# Altium project WB-AV-4502-PDB.PrjPcb
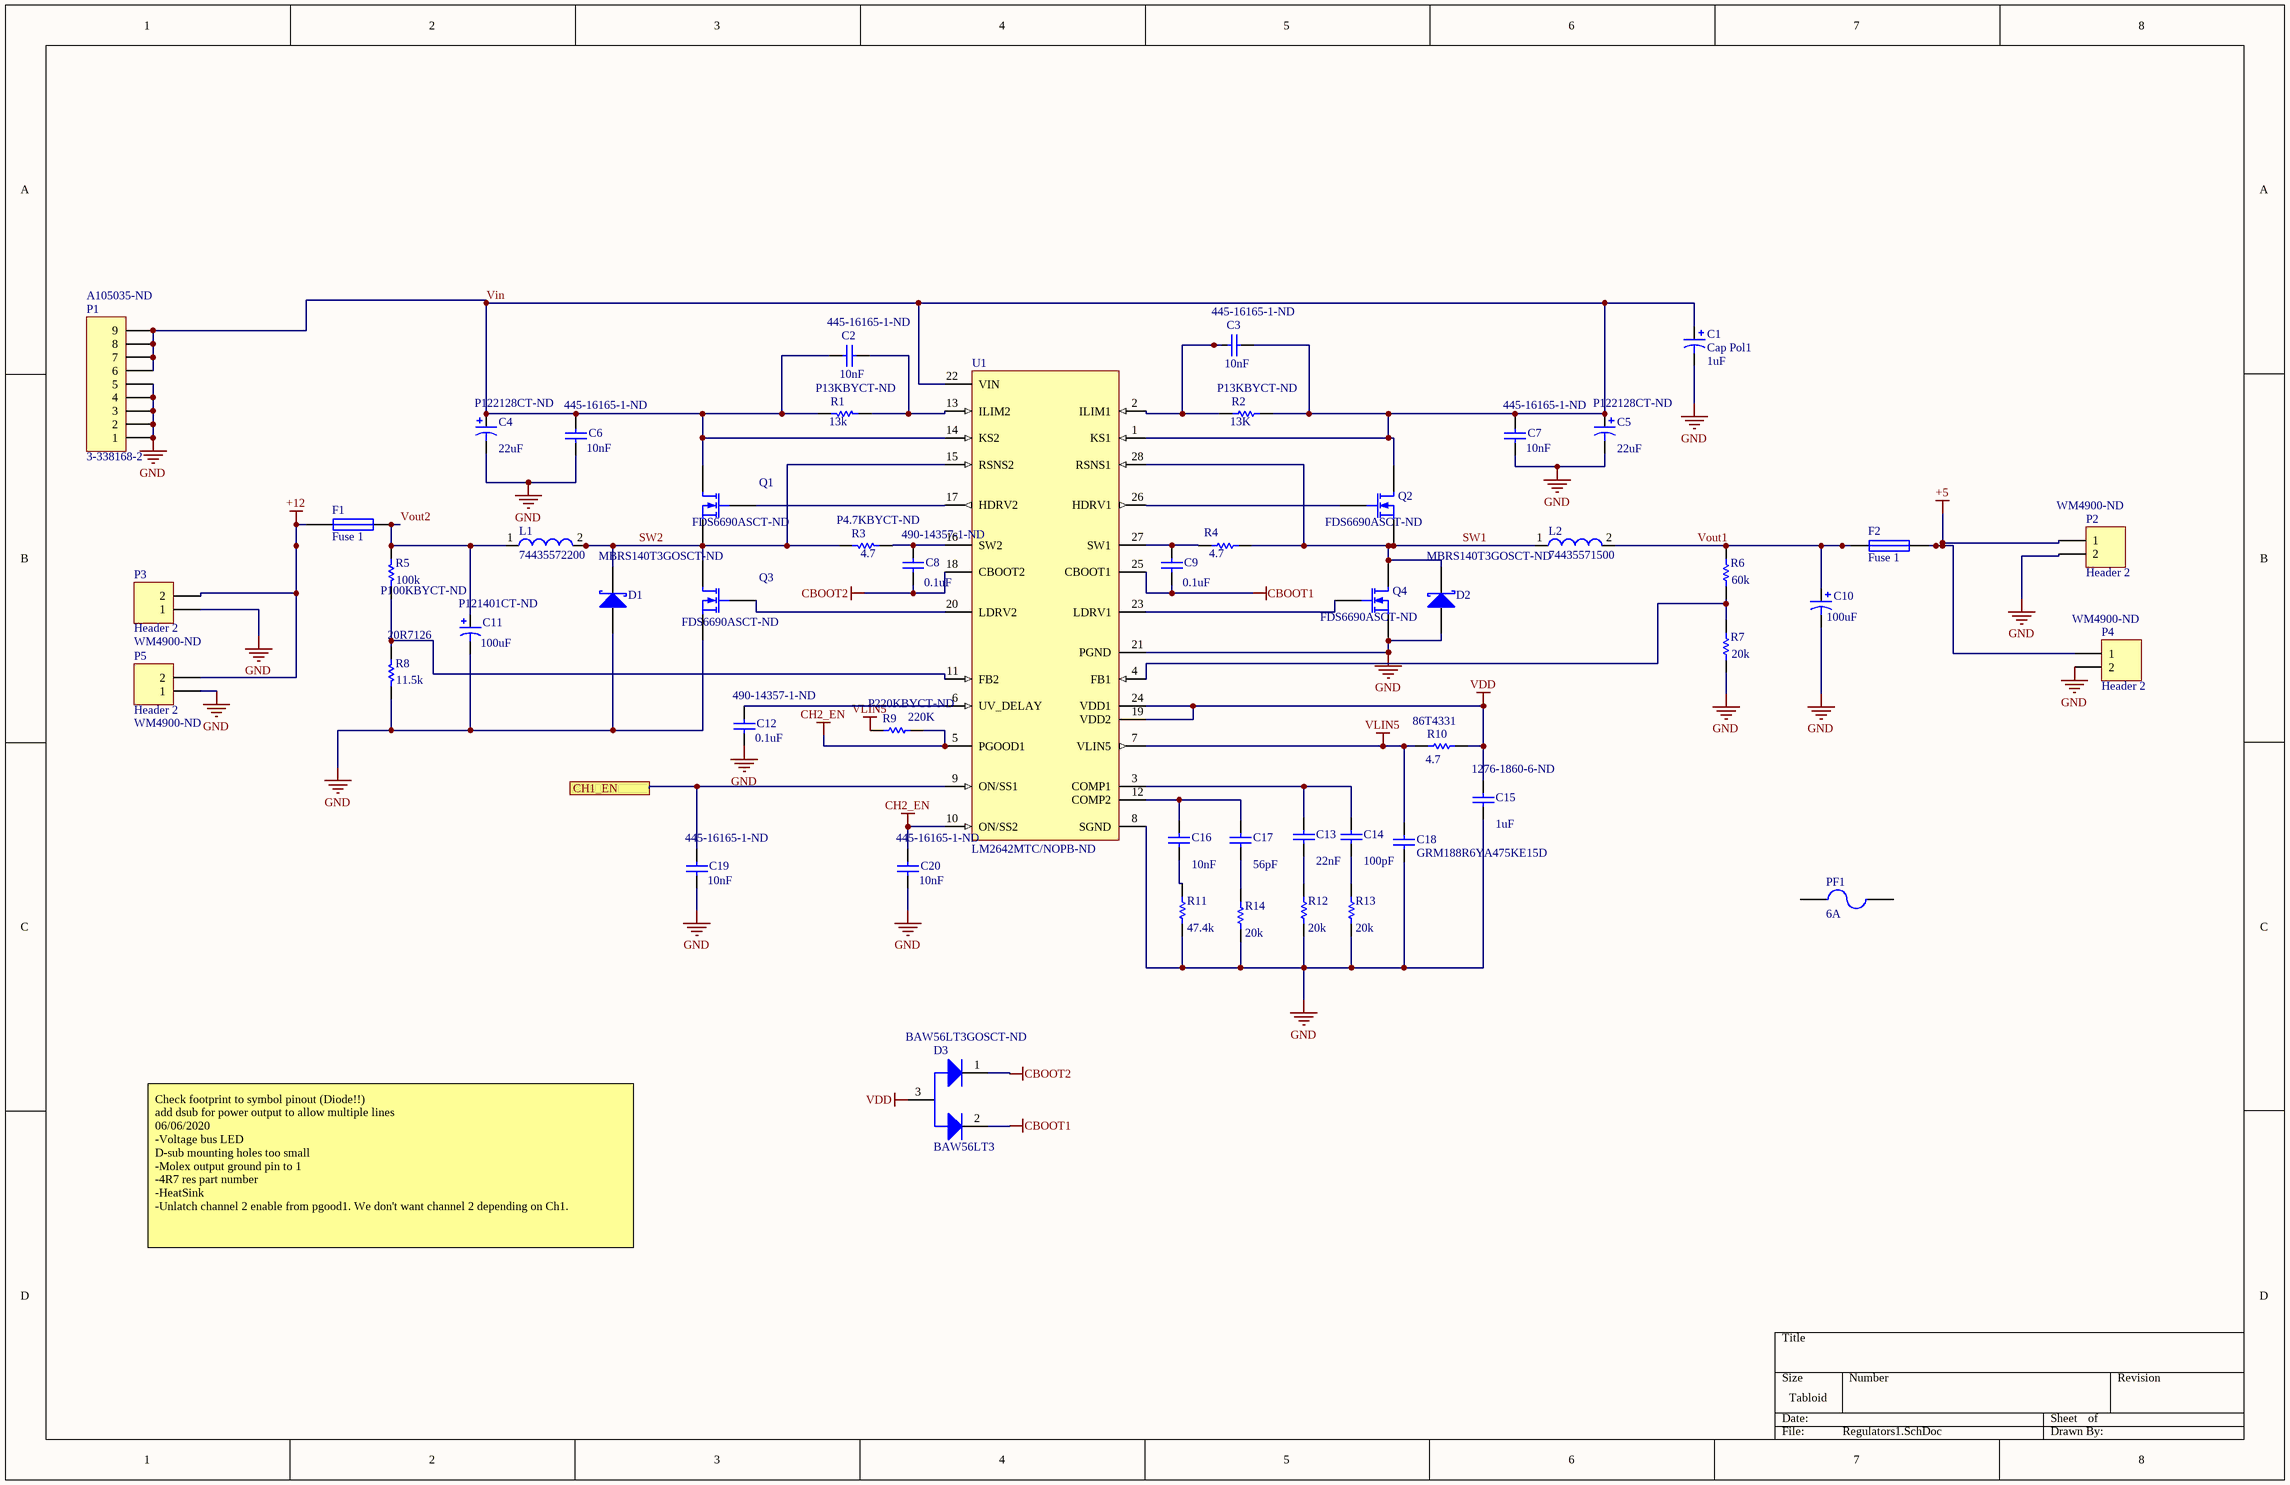
[diagram p0: Regulators1.SchDoc]
1 sheet, 52 parts. Net scope: flat (ports and power ports of the same name join across sheets).
Board file: WB-AV-4502-PDB-REV-0.pcbdoc

## Sheet Regulators1.SchDoc
size Tabloid

### Parts
C1  Cap Pol1  value 1uF  [1u50VcapE]
C2  value 10nF  Supplier Part Number 1: 445-16165-1-ND  [1608[0603]]  (hidden comment: Cap)
C3  value 10nF  Supplier Part Number 1: 445-16165-1-ND  [1608[0603]]  (hidden comment: Cap)
C4  value 22uF  Supplier Part Number 1: P122128CT-ND  [CAPAE660X800N]  (hidden comment: Cap Pol1)
C5  value 22uF  Supplier Part Number 1: P122128CT-ND  [CAPAE660X800N]  (hidden comment: Cap Pol1)
C6  value 10nF  Supplier Part Number 1: 445-16165-1-ND  [1608[0603]]  (hidden comment: Cap)
C7  value 10nF  Supplier Part Number 1: 445-16165-1-ND  [1608[0603]]  (hidden comment: Cap)
C8  value 0.1uF  Supplier Part Number 1: 490-14357-1-ND  [1608[0603]]  (hidden comment: Cap)
C9  value 0.1uF  [1608[0603]]  (hidden comment: Cap)
C10  value 100uF  [CAPAE660X800N]  (hidden comment: Cap Pol1)
C11  value 100uF  Supplier Part Number 1: P121401CT-ND  [CAPAE660X800N]  (hidden comment: Cap Pol1)
C12  value 0.1uF  Supplier Part Number 1: 490-14357-1-ND  [1608[0603]]  (hidden comment: Cap)
C13  value 22nF  [1608[0603]]  (hidden comment: Cap)
C14  value 100pF  [1608[0603]]  (hidden comment: Cap)
C15  value 1uF  Supplier Part Number 1: 1276-1860-6-ND  [1608[0603]]  (hidden comment: Cap)
C16  value 10nF  [1608[0603]]  (hidden comment: Cap)
C17  value 56pF  [1608[0603]]  (hidden comment: Cap)
C18  GRM188R6YA475KE15D  [CAPC1608X90X35LL10T15]
C19  value 10nF  Supplier Part Number 1: 445-16165-1-ND  [1608[0603]]  (hidden comment: Cap)
C20  value 10nF  Supplier Part Number 1: 445-16165-1-ND  [1608[0603]]  (hidden comment: Cap)
D1  Supplier Part Number 1: MBRS140T3GOSCT-ND  [*DIOM5227X270N_S1M(Primary)]  (hidden comment: Diode MBRS140t3)
D2  Supplier Part Number 1: MBRS140T3GOSCT-ND  [*DIOM5227X270N_S1M(Primary)]  (hidden comment: Diode MBRS140t3)
D3  BAW56LT3  Supplier Part Number 1: BAW56LT3GOSCT-ND  [ONSC-SOT-23-3-318-08_V]
F1  Fuse 1  [C1206]
F2  Fuse 1  [C1206]
L1  74435572200  [WE-HCI-1890]
L2  74435571500  [WE-HCI-1890]
P1  3-338168-2  Supplier Part Number 1: A105035-ND  [CONN_3-338168-2]
P2  Header 2  [WM4900-ND]
P3  Header 2  [WM4900-ND]
P4  Header 2  [WM4900-ND]
P5  Header 2  [WM4900-ND]
PF1  6A  [RESC3216X125N]
Q1  Supplier Part Number 1: FDS6690ASCT-ND  [*SOIC127P600X175-8N]  (hidden comment: MOSFET-N)
Q2  Supplier Part Number 1: FDS6690ASCT-ND  [*SOIC127P600X175-8N]  (hidden comment: MOSFET-N)
Q3  Supplier Part Number 1: FDS6690ASCT-ND  [*SOIC127P600X175-8N]  (hidden comment: MOSFET-N)
Q4  Supplier Part Number 1: FDS6690ASCT-ND  [*SOIC127P600X175-8N]  (hidden comment: MOSFET-N)
R1  value 13k  Supplier Part Number 1: P13KBYCT-ND  [1608[0603]]  (hidden comment: Res1)
R2  value 13K  Supplier Part Number 1: P13KBYCT-ND  [1608[0603]]  (hidden comment: Res1)
R3  value 4.7  Supplier Part Number 1: P4.7KBYCT-ND  [1608[0603]]  (hidden comment: Res1)
R4  value 4.7  [1608[0603]]  (hidden comment: Res1)
R5  value 100k  Supplier Part Number 1: P100KBYCT-ND  [1608[0603]]  (hidden comment: Res1)
R6  value 60k  [1608[0603]]  (hidden comment: Res1)
R7  value 20k  [1608[0603]]  (hidden comment: Res1)
R8  value 11.5k  Supplier Part Number 1: 20R7126  [1608[0603]]  (hidden comment: Res1)
R9  value 220K  Supplier Part Number 1: P220KBYCT-ND  [1608[0603]]  (hidden comment: Res1)
R10  value 4.7  Supplier Part Number 1: 86T4331  [1608[0603]]  (hidden comment: Res1)
R11  value 47.4k  [1608[0603]]  (hidden comment: Res1)
R12  value 20k  [1608[0603]]  (hidden comment: Res1)
R13  value 20k  [1608[0603]]  (hidden comment: Res1)
R14  value 20k  [1608[0603]]  (hidden comment: Res1)
U1  Supplier Part Number 1: LM2642MTC/NOPB-ND  [MTC28_N]  (hidden comment: LM2642MTC/NOPB)

### Ports
CH1_EN

### Nets
+5: F2.2 P2.1 P4.1
+12: F1.1 P3.2 P5.2
CBOOT1: C9.1 D3.2(K2) U1.25(CBOOT1)
CBOOT2: C8.1 D3.1(K1) U1.18(CBOOT2)
CH2_EN: C20.2 R9.2 U1.5(PGOOD1) U1.10(ON/SS2)
GND: C1.2 C4.2 C5.2 C6.1 C7.1 C10.2 C11.2 C12.1 C15.1 C18.1 C19.1 C20.1 D1.3(A) D2.3(A) P1.1 P1.2 P1.3 P1.4 P1.5 P2.2 P3.1 P4.2 P5.1 Q3.3(S) Q4.3(S) R7.1 R8.1 R11.1 R12.1 R13.1 R14.1 U1.8(SGND) U1.21(PGND)
VDD: C15.2 D3.3(A) R10.2 U1.19(VDD2) U1.24(VDD1)
VLIN5: C18.2 R9.1 R10.1 U1.7(VLIN5)
SW1: D2.1(K) L2.1 Q2.3(S) Q4.1(D) R4.2 U1.28(RSNS1)
SW2: D1.1(K) L1.2 Q1.3(S) Q3.1(D) R3.2 U1.15(RSNS2)
Vin: C1.1 C2.2 C3.1 C4.1 C5.1 C6.2 C7.2 P1.6 P1.7 P1.8 P1.9 Q1.1(D) Q2.1(D) R1.2 R2.2 U1.1(KS1) U1.14(KS2) U1.22(VIN)
Vout1: C10.1 F2.1 L2.2 R6.2
Vout2: C11.1 F1.2 L1.1 R5.2
NetC2_1: C2.1 R1.1 U1.13(ILIM2)
NetC3_2: C3.2 R2.1 U1.2(ILIM1)
NetC8_2: C8.2 R3.1 U1.16(SW2)
NetC9_2: C9.2 R4.1 U1.27(SW1)
NetC12_2: C12.2 U1.6(UV_DELAY)
NetC13_1: C13.1 R12.2
NetC13_2: C13.2 C14.2 U1.3(COMP1)
NetC14_1: C14.1 R13.2
NetC16_1: C16.1 R11.2
NetC16_2: C16.2 C17.2 U1.12(COMP2)
NetC17_1: C17.1 R14.2
NetC19_2: C19.2 U1.9(ON/SS1) ; port CH1_EN
NetQ1_2: Q1.2(G) U1.17(HDRV2)
NetQ2_2: Q2.2(G) U1.26(HDRV1)
NetQ3_2: Q3.2(G) U1.20(LDRV2)
NetQ4_2: Q4.2(G) U1.23(LDRV1)
NetR5_1: R5.1 R8.2 U1.11(FB2)
NetR6_1: R6.1 R7.2 U1.4(FB1)

Not connected (* = marked no-connect by the designer): PF1 1 2

### Notes on the sheet
- Check footprint to symbol pinout (Diode!!)
  add dsub for power output to allow multiple lines
  06/06/2020
  -Voltage bus LED
  D-sub mounting holes too small
  -Molex output ground pin to 1
  -4R7 res part number
  -HeatSink
  -Unlatch channel 2 enable from pgood1. We don't want channel 2 depending on Ch1.

### Library data of the parts
C1 = Cap Pol1: Polarized Capacitor (Radial); SPN: 865060640001; Published: 8-Jun-2000; LatestRevisionDate: 17-Jul-2002; LatestRevisionNote: Re-released for DXP Platform.; PackageReference: RB7.6-15; Publisher: Altium Limited; PackageDescription: Polarized Capacitor (Radial); 2 Leads
C2 C3 C6 C7 C16 C19 C20 = Cap: CAP CER 10000PF 100V NP0 0603; Manufacturer: TDK; Manufacturer Part Number: CGA3EANP02A103J080AC; Tolerance: 5%; Published: 8-Jun-2000; LatestRevisionDate: 17-Jul-2002; LatestRevisionNote: Re-released for DXP Platform.; PackageReference: RAD-0.3; Publisher: Altium Limited; PackageDescription: Radial Cap, Thru-Hole; 2 Leads; 0.3 in Pin Spacing; Supplier 1: Digi-Key; RoHS: Yes; Category: Ceramic Capacitors; Stock 1: 406; Pricing 1: 1=0.39000, 10=0.27200, 100=0.16300, 500=0.12226, 1000=0.10324 (USD); Mount: Surface Mount; Case/Package: 0603; Case Code (Metric): 1608; Case Code (Imperial): 0603; Min Operating Temperature: -55°C; Max Operating Temperature: 150°C; Packaging: Cut Tape; Capacitance: 10nF; Voltage Rating: 100V; Package Quantity: 1; Length: 0.063inch; Width: 0.031inch; Thickness: 0.035inch; Ratings: AEC-Q200; ComponentLink1URL: https://datasheet.ciiva.com/29540/mlcc-automotive-esd-en-29540271.pdf?src-supplier=Digi-Key; ComponentLink1Description: https://datasheet.ciiva.com/29540/mlcc-automotive-esd-en-29540271.pdf?src-supplier=Digi-Key
  C16: Supplier Part Number 1: 445-16165-1-ND
C4 C5 = Cap Pol1: Polarized Capacitor (Radial); Published: 8-Jun-2000; LatestRevisionDate: 17-Jul-2002; LatestRevisionNote: Re-released for DXP Platform.; PackageReference: RB7.6-15; Publisher: Altium Limited; PackageDescription: Polarized Capacitor (Radial); 2 Leads; Supplier 1: Digi-Key
C8 C9 C12 = Cap: CAP CER 0.1UF 50V X7R 0603; Manufacturer: Murata; Manufacturer Part Number: GCM188R71H104JA57D; Capacitance: 100nF; Tolerance: 5%; Published: 8-Jun-2000; LatestRevisionDate: 17-Jul-2002; LatestRevisionNote: Re-released for DXP Platform.; PackageReference: RAD-0.3; Publisher: Altium Limited; PackageDescription: Radial Cap, Thru-Hole; 2 Leads; 0.3 in Pin Spacing; Supplier 1: Digi-Key; RoHS: No; Category: Ceramic Capacitors; Stock 1: 31481; Pricing 1: 1=0.32000, 10=0.22100, 100=0.13260, 500=0.09944, 1000=0.08397 (USD); Mount: Surface Mount; Case/Package: 0603; Case Code (Imperial): 0603; Case Code (Metric): 1608; Min Operating Temperature: -55°C; Max Operating Temperature: 125°C; Dielectric: X7R; Voltage Rating (DC): 50V; Packaging: Cut Tape; Voltage Rating: 50V; Ratings: AEC-Q200; ComponentLink1URL: http://search.murata.co.jp/Ceramy/image/img/A01X/partnumbering_e_02.pdf?src-supplier=Digi-Key; ComponentLink1Description: http://search.murata.co.jp/Ceramy/image/img/A01X/partnumbering_e_02.pdf?src-supplier=Digi-Key; ComponentLink2URL: https://www.murata.com/~/media/webrenewal/support/library/catalog/products/capacitor/mlcc/c03e.ashx?la=en-us&src-supplier=Digi-Key; ComponentLink2Description: https://www.murata.com/~/media/webrenewal/support/library/catalog/products/capacitor/mlcc/c03e.ashx?la=en-us&src-supplier=Digi-Key
  C9: Supplier Part Number 1: 490-14357-1-ND
C10 C11 = Cap Pol1: Polarized Capacitor (Radial); SPN: P121401TR-ND; Published: 8-Jun-2000; LatestRevisionDate: 17-Jul-2002; LatestRevisionNote: Re-released for DXP Platform.; PackageReference: RB7.6-15; Publisher: Altium Limited; PackageDescription: Polarized Capacitor (Radial); 2 Leads; Supplier 1: Digi-Key
  C10: Supplier Part Number 1: P121401CT-ND
C13 = Cap: 0603 22 nF 50 V ±5% Tolerance X7R SMT Multilayer Ceramic Capacitor; Manufacturer: Walsin Technologies; Manufacturer Part Number: 0603B223J500CT; Voltage Rating: 50V; Published: 8-Jun-2000; LatestRevisionDate: 17-Jul-2002; LatestRevisionNote: Re-released for DXP Platform.; PackageReference: RAD-0.3; Publisher: Altium Limited; PackageDescription: Radial Cap, Thru-Hole; 2 Leads; 0.3 in Pin Spacing; Supplier 1: Digi-Key; Supplier Part Number 1: 1292-1414-1-ND; Category: Uncategorized; Stock 1: 14260; Pricing 1: 1=0.10000, 10=0.07500, 100=0.03350, 500=0.02390, 1000=0.01879 (USD); Case/Package: 0603; Case Code (Metric): 1608; Case Code (Imperial): 0603; Min Operating Temperature: -55°C; Max Operating Temperature: 125°C; Tolerance: 5%; Packaging: Tape and Reel; Capacitance: 22nF; Dielectric: X7R; Voltage Rating (DC): 50V; Length: 1.6mm; Depth: 0.8mm; Radiation Hardening: No; REACH SVHC: Unknown; Lead Free: Lead Free; ComponentLink1URL: https://datasheet.ciiva.com/26864/getdatasheetpartid-660917-26864527.pdf?src-supplier=Verical; ComponentLink1Description: https://datasheet.ciiva.com/26864/getdatasheetpartid-660917-26864527.pdf?src-supplier=Verical; ComponentLink2URL: http://datasheet.octopart.com/0603B223J500CT-Walsin-Technologies-datasheet-62066062.pdf?src-supplier=Element14; ComponentLink2Description: http://datasheet.octopart.com/0603B223J500CT-Walsin-Technologies-datasheet-62066062.pdf?src-supplier=Element14; ComponentLink3URL: http://datasheet.octopart.com/0603B223J500CT-Walsin-Technologies-datasheet-85392065.pdf?src-supplier=Element14; ComponentLink3Description: http://datasheet.octopart.com/0603B223J500CT-Walsin-Technologies-datasheet-85392065.pdf?src-supplier=Element14; ComponentLink4URL: http://datasheet.octopart.com/0603B223J500CT-Walsin-Technologies-datasheet-26371553.pdf; ComponentLink4Description: http://datasheet.octopart.com/0603B223J500CT-Walsin-Technologies-datasheet-26371553.pdf
C14 = Cap: Multilayer Ceramic Capacitors MLCC - SMD/SMT 100pF 50V X7R 5%; Manufacturer: Yageo; Manufacturer Part Number: CC0603JRX7R9BB101; Published: 8-Jun-2000; LatestRevisionDate: 17-Jul-2002; LatestRevisionNote: Re-released for DXP Platform.; PackageReference: RAD-0.3; Publisher: Altium Limited; PackageDescription: Radial Cap, Thru-Hole; 2 Leads; 0.3 in Pin Spacing; Supplier 1: Digi-Key; Supplier Part Number 1: 311-4003-1-ND; RoHS: Yes; Category: Ceramic Capacitors; Stock 1: 2652; Pricing 1: 1=0.11000, 10=0.08200, 100=0.03840, 500=0.02690, 1000=0.02228 (USD); Mount: Surface Mount; Case/Package: 0603; Case Code (Imperial): 0603; Case Code (Metric): 1608; Min Operating Temperature: -55°C; Max Operating Temperature: 125°C; Packaging: Tape and Reel; Tolerance: 5%; Voltage Rating: 50V; Capacitance: 100pF; Voltage Rating (DC): 50V; Package Quantity: 4000; Dielectric: X7R; Termination: SMD/SMT; Composition: Ceramic; Length: 1.6mm; Width: 0.031inch; Thickness: 0.035inch; Depth: 0.8mm; Radiation Hardening: No; Lead Free: Lead Free; Halogen Free: Halogen Free; ComponentLink1URL: https://datasheet.ciiva.com/26862/getdatasheetpartid-408467-26862784.pdf?src-supplier=Verical; ComponentLink1Description: https://datasheet.ciiva.com/26862/getdatasheetpartid-408467-26862784.pdf?src-supplier=Verical; ComponentLink2URL: https://datasheet.ciiva.com/5427/upy-gphc-x7r-6-3v-to-50v-9-270870-5427704.pdf?src-supplier=Mouser; ComponentLink2Description: https://datasheet.ciiva.com/5427/upy-gphc-x7r-6-3v-to-50v-9-270870-5427704.pdf?src-supplier=Mouser; ComponentLink3URL: https://datasheet.ciiva.com/17436/upy-gphc-x7r-6-3v-to-50v-8-17436870.pdf?src-supplier=Avnet+Europe; ComponentLink3Description: https://datasheet.ciiva.com/17436/upy-gphc-x7r-6-3v-to-50v-8-17436870.pdf?src-supplier=Avnet+Europe; ComponentLink4URL: https://datasheet.ciiva.com/11465/upy-gphc-x7r-6-3v-to-50v-8-11465037.pdf?src-supplier=Avnet; ComponentLink4Description: https://datasheet.ciiva.com/11465/upy-gphc-x7r-6-3v-to-50v-8-11465037.pdf?src-supplier=Avnet
C15 = Cap: Cap Ceramic 1uF 50V X5R 10% SMD 0603 85C Cardboard T/R; Manufacturer: Samsung; Manufacturer Part Number: CL10A105KB8NNNC; Published: 8-Jun-2000; LatestRevisionDate: 17-Jul-2002; LatestRevisionNote: Re-released for DXP Platform.; PackageReference: RAD-0.3; Publisher: Altium Limited; PackageDescription: Radial Cap, Thru-Hole; 2 Leads; 0.3 in Pin Spacing; Supplier 1: Digi-Key; RoHS: Yes; Category: Ceramic Capacitors; Stock 1: 1011841; Pricing 1: 1=0.17000, 10=0.12100, 100=0.05680, 500=0.03982, 1000=0.03297 (USD); Mount: Surface Mount; Case/Package: 0603; Case Code (Metric): 1608; Case Code (Imperial): 0603; Contact Plating: Tin; Min Operating Temperature: -55°C; Max Operating Temperature: 85°C; Package Quantity: 1; Packaging: Tape and Reel; Capacitance: 1uF; Tolerance: 10%; Voltage Rating: 50V; Dielectric: X5R; Termination: Wraparound; Length: 1.6mm; Width: 0.031inch; Thickness: 0.035inch; Depth: 0.8mm; Radiation Hardening: No; ComponentLink1URL: https://datasheet.ciiva.com/26877/getdatasheetpartid-753736-26877879.pdf?src-supplier=Verical; ComponentLink1Description: https://datasheet.ciiva.com/26877/getdatasheetpartid-753736-26877879.pdf?src-supplier=Verical
C17 = Cap: Chip Capacitor 0603 MLCC NPO 56 pF+/- 1% 50 V T&R GP; Manufacturer: Walsin Technologies; Manufacturer Part Number: 0603N560F500CT; Dielectric: C0G; Published: 8-Jun-2000; LatestRevisionDate: 17-Jul-2002; LatestRevisionNote: Re-released for DXP Platform.; PackageReference: RAD-0.3; Publisher: Altium Limited; PackageDescription: Radial Cap, Thru-Hole; 2 Leads; 0.3 in Pin Spacing; Supplier 1: Digi-Key; Supplier Part Number 1: 1292-1533-1-ND; Category: Uncategorized; Stock 1: 4492; Pricing 1: 1=0.12000, 10=0.09000, 100=0.04030, 500=0.02876, 1000=0.02260 (USD); Case/Package: 0603; Min Operating Temperature: -55°C; Max Operating Temperature: 125°C; Tolerance: 1%; Packaging: Tape and Reel; Capacitance: 56pF; Length: 1.6mm; Depth: 0.8mm; ComponentLink1URL: http://components.arrow.com/part/dataview/0323_03468640?src-supplier=Arrow+Europe; ComponentLink1Description: http://components.arrow.com/part/dataview/0323_03468640?src-supplier=Arrow+Europe; ComponentLink2URL: http://datasheet.octopart.com/0603N560F500CT-Walsin-Technologies-datasheet-26371553.pdf; ComponentLink2Description: http://datasheet.octopart.com/0603N560F500CT-Walsin-Technologies-datasheet-26371553.pdf
C18 = CMP-2006-02545-1: Manufacturer: Murata; Part Number: GRM188R6YA475KE15D
D1 D2 = Diode 18TQ045: Schottky Rectifier; pin to pad: 1>C 3>A; Note: Terminal 2 is the TAB and is electrically connected to the cathode; Published: 8-Jun-2000; LatestRevisionDate: 17-Jul-2002; LatestRevisionNote: Re-released for DXP Platform.; DatasheetVersion: Dec-1997; PackageVersion: Feb-1998; PackageReference: TO-220AC; Publisher: Altium Limited; PackageDescription: TO, Thru-Hole, Vertical, Heatsink Mounted; 3 In-Line Leads (1 Absent); Pitch 2.54 mm; ComponentLink1Description: Manufacturer Link; ComponentLink1URL: http://www.irf.com/; ComponentLink2Description: Datasheet; ComponentLink2URL: http://www.irf.com/product-info/datasheets/data/18tq.pdf; SPN: MBRS140T3GOSCT-ND; Supplier 1: Digi-Key
D3 = BAW56LT3: Diode Small Signal Switching 70V 0.2A Automotive 3-Pin SOT-23 T/R; Manufacturer: On Semiconductor; Manufacturer Part Number: BAW56LT3G; Note: 0; Configuration: Common Anode; IF Max (A): 0.2; Packing: Tape and Reel; trr Max (ns): 6; Forward Current: 200mA; Peak Reverse Current: 2.5uA; Max Surge Current: 4A; Recovery Time: 6ns; Forward Voltage: 1.25V; Power Dissipation: 300mW; DatasheetVersion: Rev. 8; PackageVersion: Rev. AP, 11/2009; PackageReference: SOT-23-3-318-08; PackageDescription: 3-Pin Small Outline Transistor, Body 2.92 x 1.3 mm, Pitch 0.95 mm; RoHS: FALSE; Mounting Technology: Surface Mount; PartNumber: BAW56LT3; ComponentLink1Description: Manufacturer URL; ComponentLink1URL: http://www.onsemi.com/; ComponentLink2Description: Datasheet; ComponentLink2URL: http://www.onsemi.cn/pub_link/Collateral/BAW56LT1-D.PDF; ComponentLink3Description: Package Specification; ComponentLink3URL: http://www.onsemi.cn/pub_link/Collateral/318-08.PDF; SPN: BAW56LT3GOSCT-ND; Supplier 1: Digi-Key; Category: Rectifier Diodes; Stock 1: 152542; Pricing 1: 1=0.10000, 10=0.09200, 25=0.08760, 100=0.03850, 250=0.03696, 500=0.03024, 1000=0.02100, 2500=0.01834, 5000=0.01645 (USD); Case/Package: SOT-23-3; Number of Pins: 3; Contact Plating: Tin; Min Operating Temperature: -55°C; Max Operating Temperature: 150°C; Package Quantity: 10000; Element Configuration: Common Anode; Packaging: Tape and Reel; Average Rectified Current: 200mA; Reverse Recovery Time: 6ns; Max Reverse Leakage Current: 2.5uA; Max Repetitive Reverse Voltage (Vrrm): 70V; Peak Non-Repetitive Surge Current: 4A; Max Forward Surge Current (Ifsm): 4A; Current Rating: 200mA; Voltage Rating (DC): 70V; Max Reverse Voltage (DC): 70V; Length: 3.04mm; Height: 1.01mm; Width: 1.4mm; Radiation Hardening: No; REACH SVHC: No SVHC; Lead Free: Lead Free; Halogen Free: Halogen Free; ComponentLink4URL: https://datasheet.ciiva.com/905/baw56lt1-d-905777.pdf?src-supplier=Avnet; ComponentLink4Description: https://datasheet.ciiva.com/905/baw56lt1-d-905777.pdf?src-supplier=Avnet; ComponentLink5URL: https://datasheet.ciiva.com/908/baw56lt1-d-908265.pdf?src-supplier=Digi-Key; ComponentLink5Description: https://datasheet.ciiva.com/908/baw56lt1-d-908265.pdf?src-supplier=Digi-Key; ComponentLink6URL: https://datasheet.ciiva.com/908/baw56lt1-d-908266.pdf?src-supplier=Digi-Key; ComponentLink6Description: https://datasheet.ciiva.com/908/baw56lt1-d-908266.pdf?src-supplier=Digi-Key; ComponentLink7URL: https://datasheet.ciiva.com/8053/baw56lt1-d-8053691.pdf?src-supplier=Element14; ComponentLink7Description: https://datasheet.ciiva.com/8053/baw56lt1-d-8053691.pdf?src-supplier=Element14; ComponentLink8URL: https://datasheet.ciiva.com/908/baw56lt1-d-908264.pdf?src-supplier=Digi-Key; ComponentLink8Description: https://datasheet.ciiva.com/908/baw56lt1-d-908264.pdf?src-supplier=Digi-Key; ComponentLink9URL: http://datasheet.octopart.com/BAW56LT3G-ON-Semiconductor-datasheet-8326890.pdf?src-supplier=ON+Semiconductor; ComponentLink9Description: http://datasheet.octopart.com/BAW56LT3G-ON-Semiconductor-datasheet-8326890.pdf?src-supplier=ON+Semiconductor; ComponentLink10URL: http://datasheet.octopart.com/BAW56LT3G-ON-Semiconductor-datasheet-572709.pdf?src-supplier=ON+Semiconductor; ComponentLink10Description: http://datasheet.octopart.com/BAW56LT3G-ON-Semiconductor-datasheet-572709.pdf?src-supplier=ON+Semiconductor; ComponentLink11URL: http://datasheet.octopart.com/BAW56LT3G-ON-Semiconductor-datasheet-93401127.pdf?src-supplier=ON+Semiconductor; ComponentLink11Description: http://datasheet.octopart.com/BAW56LT3G-ON-Semiconductor-datasheet-93401127.pdf?src-supplier=ON+Semiconductor; ComponentLink12URL: http://datasheet.octopart.com/BAW56LT3G-ON-Semiconductor-datasheet-12530666.pdf?src-supplier=Newark; ComponentLink12Description: http://datasheet.octopart.com/BAW56LT3G-ON-Semiconductor-datasheet-12530666.pdf?src-supplier=Newark; ComponentLink13URL: http://datasheet.octopart.com/BAW56LT3G-ON-Semiconductor-datasheet-11771802.pdf?src-supplier=Arrow; ComponentLink13Description: http://datasheet.octopart.com/BAW56LT3G-ON-Semiconductor-datasheet-11771802.pdf?src-supplier=Arrow
F1 F2 = Fuse 1: Fuse; SPN: 118-MF-NSML600/6-2TR-ND; Published: 8-Jun-2000; LatestRevisionDate: 17-Jul-2002; LatestRevisionNote: Re-released for DXP Platform.; PackageReference: PIN-W2/E2.8; Publisher: Altium Limited; PackageDescription: Thru-Hole; 2 Leads
L1 = CMP-0226-00010-1: SMD Flat Wire High Current Inductor WE-HCI, L=22.0 µH; Inductance: 22.0 ÂµH; PackageReference: WE-HCI-1890; ComponentLink1URL: http://www.we-online.com; DatasheetVersion: ver 2, Nov-2009; ComponentLink1Description: Manufacturer Link; PackageDescription: Inductor, 2-Leads, Body 18.3 x 18.2 mm; PackageVersion: 2009; ComponentLink2URL: http://www.we-online.de/katalog/media/pdf/74435572200.pdf; ComponentLink2Description: Datasheet; SPN: 74435572200
L2 = CMP-0226-00009-1: SMD Flat Wire High Current Inductor WE-HCI, L=15.0 µH; Inductance: 15.0 ÂµH; ComponentLink2URL: http://www.we-online.de/katalog/media/pdf/74435571500.pdf; PackageReference: WE-HCI-1890; PackageDescription: Inductor, 2-Leads, Body 18.3 x 18.2 mm; PackageVersion: 2009; ComponentLink1URL: http://www.we-online.com; ComponentLink2Description: Datasheet; DatasheetVersion: ver 2, Nov-2009; ComponentLink1Description: Manufacturer Link; SPN: 74435571500
P1 = Header 9: Header, 9-Pin; LatestRevisionDate: 17-Jul-2002; LatestRevisionNote: Re-released for DXP Platform.; Publisher: Altium Limited; MPN: 3-338168-2; SPN: A105035-ND; Supplier 1: Digi-Key
P2-P5 = Header 2: Header, 2-Pin; LatestRevisionDate: 17-Jul-2002; LatestRevisionNote: Re-released for DXP Platform.; Publisher: Altium Limited; Supplier 1: Digi-Key; Supplier Part Number 1: WM4900-ND
PF1 = Fuse 2: Fuse; SPN: 118-MF-NSML600/6-2TR-ND; Published: 8-Jun-2000; LatestRevisionDate: 17-Jul-2002; LatestRevisionNote: Re-released for DXP Platform.; PackageReference: PIN-W2/E2.8; Publisher: Altium Limited; PackageDescription: Thru-Hole; 2 Leads
Q1-Q4 = MOSFET-N: N-Channel MOSFET; Published: 8-Jun-2000; LatestRevisionDate: 17-Jul-2002; LatestRevisionNote: Re-released for DXP Platform.; PackageVersion: 1995/1996; PackageReference: E3; Publisher: Altium Limited; PackageDescription: TO, Flat Index; 3 In-Line, Axial Leads; Body Dia. 4.6mm; Lead Dia. 0.5 mm (max); SPN: FDS6690ASCT-ND; Supplier 1: Digi-Key
R1 R2 = Res1: PANASONIC   ERJPA3F1302V   RESISTOR, ERJP, 13 KOHM, 0603, 0.25W, 1%; Manufacturer Part Number: ERJ-PA3F1302V; Resistance: 13kR; Power Rating: 250mW; Voltage Rating: 150V; Temperature Coefficient: 100ppm/°C; Published: 8-Jun-2000; LatestRevisionDate: 17-Jul-2002; LatestRevisionNote: Re-released for DXP Platform.; PackageReference: AXIAL-0.3; Publisher: Altium Limited; PackageDescription: Axial Device, Thru-Hole; 2 Leads; 0.3 in Pin Spacing; Supplier 1: Digi-Key; Manufacturer: Panasonic; RoHS: Yes; Category: Chip SMD Resistors; Stock 1: 12174; Pricing 1: 1=0.14000, 10=0.12700, 100=0.04900, 1000=0.02156, 2500=0.01862 (USD); Mount: Surface Mount; Case/Package: 0603; Case Code (Metric): 1608; Case Code (Imperial): 0603; Contact Plating: Tin; Min Operating Temperature: -55°C; Max Operating Temperature: 155°C; Tolerance: 1%; Packaging: Cut Tape; Number of Terminations: 2; Termination: Wraparound; Composition: Thick Film; Max Power Dissipation: 250mW; Voltage Rating (DC): 150V; Features: Automotive AEC-Q200; Length: 1.6mm; Height: 0.018inch; Width: 0.031inch; Depth: 0.8mm; REACH SVHC: No SVHC; ComponentLink1URL: https://datasheet.ciiva.com/22681/1801181-22681719.pdf?src-supplier=Element14; ComponentLink1Description: https://datasheet.ciiva.com/22681/1801181-22681719.pdf?src-supplier=Element14; ComponentLink2URL: https://datasheet.ciiva.com/49048/1801181-49048140.pdf?src-supplier=Element14; ComponentLink2Description: https://datasheet.ciiva.com/49048/1801181-49048140.pdf?src-supplier=Element14
R3 R4 = Res1: PANASONIC   ERJPA3F4701V   RESISTOR, ERJP, 4.7KOHM, 0603, 0.25W, 1%; Manufacturer Part Number: ERJ-PA3F4701V; Power Rating: 250mW; Resistance: 4.7kR; Temperature Coefficient: 100ppm/°C; Voltage Rating (DC): 150V; Published: 8-Jun-2000; LatestRevisionDate: 17-Jul-2002; LatestRevisionNote: Re-released for DXP Platform.; PackageReference: AXIAL-0.3; Publisher: Altium Limited; PackageDescription: Axial Device, Thru-Hole; 2 Leads; 0.3 in Pin Spacing; Supplier 1: Digi-Key; Manufacturer: Panasonic; RoHS: Yes; Category: Chip SMD Resistors; Stock 1: 29328; Pricing 1: 1=0.14000, 10=0.12700, 100=0.04900, 1000=0.02156, 2500=0.01862 (USD); Mount: Surface Mount; Case/Package: 0603; Case Code (Metric): 1608; Case Code (Imperial): 0603; Contact Plating: Tin; Min Operating Temperature: -55°C; Max Operating Temperature: 155°C; Tolerance: 1%; Packaging: Cut Tape; Voltage Rating: 150V; Composition: Thick Film; Termination: Solder; Number of Terminations: 2; Max Power Dissipation: 250mW; Features: Automotive AEC-Q200; Length: 0.063inch; Height: 0.018inch; Depth: 0.8mm; Width: 0.031inch; REACH SVHC: No SVHC; ComponentLink1URL: https://datasheet.ciiva.com/22781/1801181-22781562.pdf?src-supplier=Farnell; ComponentLink1Description: https://datasheet.ciiva.com/22781/1801181-22781562.pdf?src-supplier=Farnell; ComponentLink2URL: https://datasheet.ciiva.com/22667/1801181-22667926.pdf?src-supplier=Element14; ComponentLink2Description: https://datasheet.ciiva.com/22667/1801181-22667926.pdf?src-supplier=Element14
  R4: Supplier Part Number 1: P4.7KBYCT-ND
R5 = Res1: ERJPA3 Resistors 0.25W 0603 100K 1%; Manufacturer: Panasonic; Manufacturer Part Number: ERJ-PA3F1003V; Resistance: 100kR; Power Rating: 250mW; Voltage Rating: 150V; Temperature Coefficient: 100ppm/°C; Published: 8-Jun-2000; LatestRevisionDate: 17-Jul-2002; LatestRevisionNote: Re-released for DXP Platform.; PackageReference: AXIAL-0.3; Publisher: Altium Limited; PackageDescription: Axial Device, Thru-Hole; 2 Leads; 0.3 in Pin Spacing; Supplier 1: Digi-Key; RoHS: Yes; Category: Chip SMD Resistors; Stock 1: 48831; Pricing 1: 1=0.14000, 10=0.12700, 100=0.04900, 1000=0.02156, 2500=0.01862 (USD); Mount: Surface Mount; Case/Package: 0603; Case Code (Metric): 1608; Case Code (Imperial): 0603; Min Operating Temperature: -55°C; Max Operating Temperature: 155°C; Tolerance: 1%; Packaging: Cut Tape; Composition: Thick Film; Voltage Rating (DC): 150V; Number of Terminations: 2; Termination: Solder; Max Power Dissipation: 250mW; Features: Automotive AEC-Q200; Length: 0.063inch; Height: 0.018inch; Width: 0.031inch; Depth: 0.8mm; REACH SVHC: No SVHC; ComponentLink1URL: https://datasheet.ciiva.com/22781/1801181-22781557.pdf?src-supplier=Farnell; ComponentLink1Description: https://datasheet.ciiva.com/22781/1801181-22781557.pdf?src-supplier=Farnell; ComponentLink2URL: https://datasheet.ciiva.com/49048/1801181-49048299.pdf?src-supplier=Element14; ComponentLink2Description: https://datasheet.ciiva.com/49048/1801181-49048299.pdf?src-supplier=Element14
R6 = Res1: RES SMD 60.4K OHM 0.1% 1/5W 0603; Manufacturer: Panasonic; Manufacturer Part Number: ERJ-PB3B6042V; Resistance: 60.4kR; Max Power Dissipation: 200mW; Temperature Coefficient: 50ppm/°C; Published: 8-Jun-2000; LatestRevisionDate: 17-Jul-2002; LatestRevisionNote: Re-released for DXP Platform.; PackageReference: AXIAL-0.3; Publisher: Altium Limited; PackageDescription: Axial Device, Thru-Hole; 2 Leads; 0.3 in Pin Spacing; Supplier 1: Digi-Key; Supplier Part Number 1: P20175CT-ND; RoHS: Yes; Category: Chip SMD Resistors; Stock 1: 1247; Pricing 1: 1=0.25000, 10=0.21100, 25=0.15320, 50=0.11100, 100=0.08230, 250=0.06316, 500=0.04976, 1000=0.03445 (USD); Case/Package: 0603; Case Code (Metric): 1608; Case Code (Imperial): 0603; Min Operating Temperature: -55°C; Max Operating Temperature: 155°C; Packaging: Tape and Reel; Composition: Thick Film; Number of Terminations: 2; Tolerance: 0.1%; Features: Automotive AEC-Q200; Length: 0.063inch; Width: 0.032inch; Height - Seated (Max): 0.022inch; ComponentLink1URL: https://industrial.panasonic.com/sa/system/files/data/download/catalog/id_fixed-resistors_e_2.pdf?src-supplier=Digi-Key; ComponentLink1Description: https://industrial.panasonic.com/sa/system/files/data/download/catalog/id_fixed-resistors_e_2.pdf?src-supplier=Digi-Key; ComponentLink2URL: https://industrial.panasonic.com/cdbs/www-data/pdf/RDM0000/DMM0000COL5.pdf?src-supplier=Digi-Key; ComponentLink2Description: https://industrial.panasonic.com/cdbs/www-data/pdf/RDM0000/DMM0000COL5.pdf?src-supplier=Digi-Key
R7 R12-R14 = Res1: RES SMD 20K OHM 0.1% 1/10W 0603; Manufacturer: TE Connectivity AMP; Manufacturer Part Number: RP73D1J20KBTG; Power Rating: 100mW; Resistance: 20kR; Temperature Coefficient: 15ppm/°C; Voltage Rating: 75V; Number of Resistors: 1; Published: 8-Jun-2000; LatestRevisionDate: 17-Jul-2002; LatestRevisionNote: Re-released for DXP Platform.; PackageReference: AXIAL-0.3; Publisher: Altium Limited; PackageDescription: Axial Device, Thru-Hole; 2 Leads; 0.3 in Pin Spacing; Supplier 1: Digi-Key; Supplier Part Number 1: RP73D1J20KBTG-ND; RoHS: No; Category: Chip SMD Resistors; Pricing 1: 250=0.75212 (USD); Mount: Surface Mount; Case/Package: 0603; Packaging: Cut Tape; Tolerance: 0.1%; Number of Terminations: 2; Termination: Solder; ELV: Compliant; ComponentLink1URL: http://www.te.com/commerce/DocumentDelivery/DDEController?Action=srchrtrv&DocNm=1773272&DocType=DS&DocLang=English&src-supplier=Digi-Key; ComponentLink1Description: http://www.te.com/commerce/DocumentDelivery/DDEController?Action=srchrtrv&DocNm=1773272&DocType=DS&DocLang=English&src-supplier=Digi-Key
R8 = Res1: Thin Film Resistors RN 0603 11K5 0.1% 10PPM CUT LENGTH; Manufacturer: TE Connectivity; Manufacturer Part Number: RN73C1J11K5BTG; Voltage Rating: 50V; Resistance: 11.5kR; Power Rating: 63mW; Temperature Coefficient: 10ppm/°C; Number of Resistors: 1; Published: 8-Jun-2000; LatestRevisionDate: 17-Jul-2002; LatestRevisionNote: Re-released for DXP Platform.; PackageReference: AXIAL-0.3; Publisher: Altium Limited; PackageDescription: Axial Device, Thru-Hole; 2 Leads; 0.3 in Pin Spacing; Supplier 1: Newark; RoHS: Yes; Category: Chip SMD Resistors; Pricing 1: 250=1.20000, 1000=1.16000, 2000=1.12000, 4000=1.09000, 6000=1.06000, 10000=1.03000 (CAD); Mount: Surface Mount; Case/Package: 0603; Case Code (Metric): 1608; Case Code (Imperial): 0603; Min Operating Temperature: -55°C; Max Operating Temperature: 155°C; Tolerance: 0.1%; Packaging: Cut Tape; Termination: Solder; Number of Terminations: 2; Package Quantity: 250; Composition: Thin Film; Military Standard: Not; Length: 1.55mm; Height: 0.45mm; Width: 0.8mm; Depth: 0.8mm; ELV: Compliant; ComponentLink1URL: http://components.arrow.com/part/dataview/0323_02389628?src-supplier=Arrow+Europe; ComponentLink1Description: http://components.arrow.com/part/dataview/0323_02389628?src-supplier=Arrow+Europe; ComponentLink2URL: http://www.mouser.com/ds/2/418/NG_CD_1614350_BA-654184.pdf?src-supplier=Mouser; ComponentLink2Description: http://www.mouser.com/ds/2/418/NG_CD_1614350_BA-654184.pdf?src-supplier=Mouser; ComponentLink3URL: https://media.digikey.com/pdf/Data%20Sheets/Tyco%20Electonics%20AMP%20PDFs/RN73_Series_2011.pdf?src-supplier=Digi-Key; ComponentLink3Description: https://media.digikey.com/pdf/Data%20Sheets/Tyco%20Electonics%20AMP%20PDFs/RN73_Series_2011.pdf?src-supplier=Digi-Key
R9 = Res1: RES SMD 220K OHM 1% 1/4W 0603; Manufacturer: Panasonic; Manufacturer Part Number: ERJ-PA3F2203V; Resistance: 220kR; Power Rating: 250mW; Voltage Rating: 150V; Temperature Coefficient: 100ppm/°C; Published: 8-Jun-2000; LatestRevisionDate: 17-Jul-2002; LatestRevisionNote: Re-released for DXP Platform.; PackageReference: AXIAL-0.3; Publisher: Altium Limited; PackageDescription: Axial Device, Thru-Hole; 2 Leads; 0.3 in Pin Spacing; Supplier 1: Digi-Key; RoHS: Yes; Category: Chip SMD Resistors; Stock 1: 88662; Pricing 1: 1=0.14000, 10=0.12700, 100=0.04900, 1000=0.02156, 2500=0.01862 (USD); Mount: Surface Mount; Case/Package: 0603; Case Code (Metric): 1608; Case Code (Imperial): 0603; Min Operating Temperature: -55°C; Max Operating Temperature: 155°C; Tolerance: 1%; Composition: Thick Film; Packaging: Cut Tape; Number of Terminations: 2; Termination: Solder; Max Power Dissipation: 250mW; Voltage Rating (DC): 150V; Features: Automotive AEC-Q200; Length: 0.063inch; Height: 0.018inch; Width: 0.031inch; Depth: 0.8mm; REACH SVHC: No SVHC; ComponentLink1URL: https://datasheet.ciiva.com/49048/1801181-49048155.pdf?src-supplier=Element14; ComponentLink1Description: https://datasheet.ciiva.com/49048/1801181-49048155.pdf?src-supplier=Element14; ComponentLink2URL: https://datasheet.ciiva.com/22782/1801181-22782469.pdf?src-supplier=Farnell; ComponentLink2Description: https://datasheet.ciiva.com/22782/1801181-22782469.pdf?src-supplier=Farnell
R10 = Res1: MULTICOMP - MCSR06X4701FTL - RES, CERAMIC, 4K7, 1%, 0.1W, 0603; Resistance: 4.7kR; Temperature Coefficient: 100ppm/°C; Power Rating: 100mW; Voltage Rating: 75V; Published: 8-Jun-2000; LatestRevisionDate: 17-Jul-2002; LatestRevisionNote: Re-released for DXP Platform.; PackageReference: AXIAL-0.3; Publisher: Altium Limited; PackageDescription: Axial Device, Thru-Hole; 2 Leads; 0.3 in Pin Spacing; Supplier 1: Newark; Manufacturer: Multicomp; Manufacturer Part Number: MCSR06X4701FTL; RoHS: Yes; Category: Chip SMD Resistors; Pricing 1: 10=0.04200, 25=0.03100, 50=0.02300, 100=0.01800, 500=0.01400, 1000=0.01100, 5000=0.00800 (CAD); Case/Package: 0603; Case Code (Metric): 1608; Case Code (Imperial): 0603; Tolerance: 1%; Composition: Ceramic; Packaging: Cut Tape; Voltage Rating (DC): 75V; REACH SVHC: No SVHC; ComponentLink1URL: https://datasheet.ciiva.com/7919/1716711-7919038.pdf?src-supplier=Element14; ComponentLink1Description: https://datasheet.ciiva.com/7919/1716711-7919038.pdf?src-supplier=Element14
R11 = Res1: RES SMD 47.5K OHM 0.1% 1/5W 0603; Manufacturer: Panasonic; Manufacturer Part Number: ERJ-PB3B4752V; Resistance: 47.5kR; Max Power Dissipation: 200mW; Temperature Coefficient: 50ppm/°C; Published: 8-Jun-2000; LatestRevisionDate: 17-Jul-2002; LatestRevisionNote: Re-released for DXP Platform.; PackageReference: AXIAL-0.3; Publisher: Altium Limited; PackageDescription: Axial Device, Thru-Hole; 2 Leads; 0.3 in Pin Spacing; Supplier 1: Digi-Key; Supplier Part Number 1: P20163CT-ND; RoHS: Yes; Category: Chip SMD Resistors; Stock 1: 9691; Pricing 1: 1=0.25000, 10=0.21100, 25=0.15320, 50=0.11100, 100=0.08230, 250=0.06316, 500=0.04976, 1000=0.03445 (USD); Case/Package: 0603; Case Code (Metric): 1608; Case Code (Imperial): 0603; Min Operating Temperature: -55°C; Max Operating Temperature: 155°C; Packaging: Tape and Reel; Composition: Thick Film; Number of Terminations: 2; Tolerance: 0.1%; Features: Automotive AEC-Q200; Length: 0.063inch; Width: 0.032inch; Height - Seated (Max): 0.022inch; ComponentLink1URL: https://industrial.panasonic.com/sa/system/files/data/download/catalog/id_fixed-resistors_e_2.pdf?src-supplier=Digi-Key; ComponentLink1Description: https://industrial.panasonic.com/sa/system/files/data/download/catalog/id_fixed-resistors_e_2.pdf?src-supplier=Digi-Key
U1 = LM2642MTC/NOPB: Two-Phase Synchronous Step-Down Switching Controller, 28-pin TSSOP, Pb-Free; Manufacturer: National Semiconductor; PackageTopMarking: NSUZXYTTE#*LM2642MTC; PowerWise: N; CompType: Switcher; High-Reliability: Y; DatasheetVersion: Feb-2006; PackageVersion: revD, Jan-2005; PackageReference: MTC28; PackageDescription: Molded TSSOP, Jedec, 9.7 x 4.4 x 0.9mm Body, 28 Lead, 0.65mm Pitch; PartNumber: LM2642MTC/NOPB; RoHS: Y; PinCount: 28; Code_JEDEC: MO-153-AE; ComponentLink1Description: Manufacturer URL; ComponentLink1URL: http://www.national.com/; ComponentLink2Description: LM2642 Datasheet; ComponentLink2URL: http://www.national.com/ds/LM/LM2642.pdf; ComponentLink3Description: LM2642 Web Page; ComponentLink3URL: http://www.national.com/pf/LM/LM2642.html; ComponentLink4Description: MTC28 Package Page; ComponentLink4URL: http://www.national.com/packaging/folders/mtc28.html; Supplier 1: Digi-Key